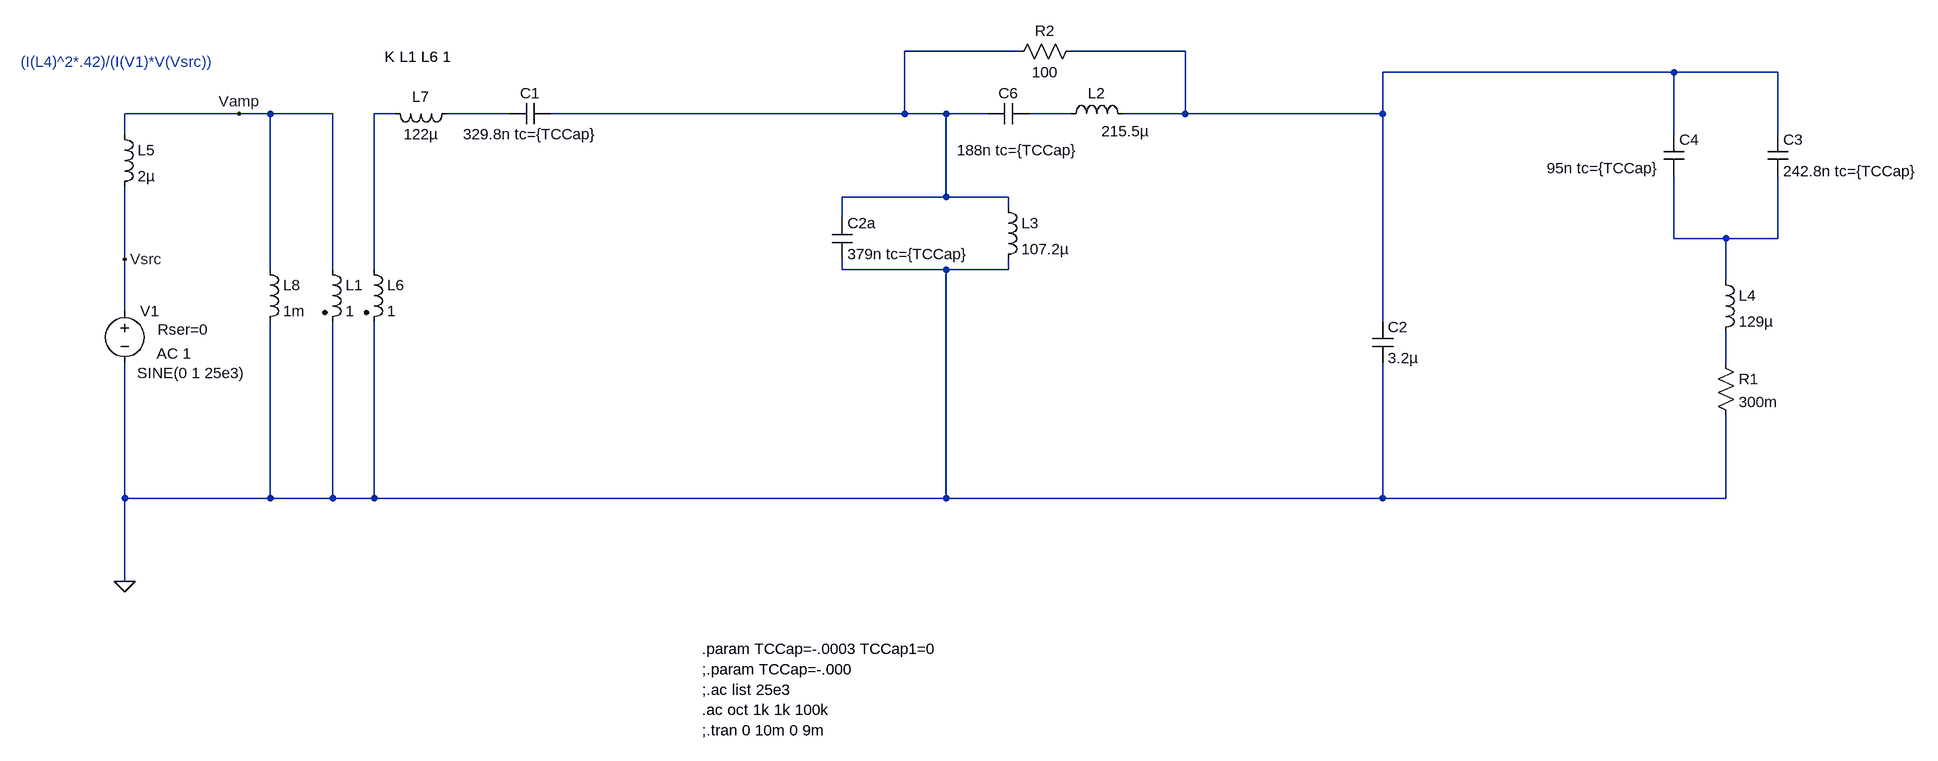
[diagram p0: schematic tx_filter_Meas_values-OS-MPI.asc]
tx_filter_Meas_values-OS-MPI.asc, the LTspice schematic file:
Version 4
SHEET 1 2608 1188
WIRE 1200 -32 1024 -32
WIRE 1456 -32 1280 -32
WIRE 2208 0 1760 0
WIRE 2368 0 2208 0
WIRE 0 64 -176 64
WIRE 48 64 0 64
WIRE 144 64 48 64
WIRE 240 64 208 64
WIRE 416 64 320 64
WIRE 1024 64 1024 -32
WIRE 1024 64 480 64
WIRE 1088 64 1024 64
WIRE 1152 64 1088 64
WIRE 1280 64 1216 64
WIRE 1456 64 1456 -32
WIRE 1456 64 1360 64
WIRE 1760 64 1760 0
WIRE 1760 64 1456 64
WIRE -176 96 -176 64
WIRE 2208 96 2208 0
WIRE 2368 96 2368 0
WIRE 1088 192 1088 64
WIRE 1088 192 928 192
WIRE 1184 192 1088 192
WIRE 1184 208 1184 192
WIRE 928 224 928 192
WIRE 2208 256 2208 160
WIRE 2288 256 2208 256
WIRE 2368 256 2368 160
WIRE 2368 256 2288 256
WIRE -176 288 -176 176
WIRE 48 304 48 64
WIRE 144 304 144 64
WIRE 208 304 208 64
WIRE 928 304 928 288
WIRE 1088 304 928 304
WIRE 1184 304 1184 288
WIRE 1184 304 1088 304
WIRE 2288 320 2288 256
WIRE -176 368 -176 288
WIRE 1760 384 1760 64
WIRE 2288 448 2288 400
WIRE -176 656 -176 448
WIRE 48 656 48 384
WIRE 48 656 -176 656
WIRE 144 656 144 384
WIRE 144 656 48 656
WIRE 208 656 208 384
WIRE 208 656 144 656
WIRE 1088 656 1088 304
WIRE 1088 656 208 656
WIRE 1760 656 1760 448
WIRE 1760 656 1088 656
WIRE 2288 656 2288 528
WIRE 2288 656 1760 656
WIRE -176 784 -176 656
FLAG 0 64 Vamp
FLAG -176 784 0
FLAG -176 288 Vsrc
SYMBOL voltage -176 352 R0
WINDOW 123 49 81 Left 2
WINDOW 39 51 44 Left 2
WINDOW 3 19 111 Left 2
SYMATTR Value2 AC 1
SYMATTR SpiceLine Rser=0
SYMATTR Value SINE(0 1 25e3)
SYMATTR InstName V1
SYMBOL ind 1264 80 R270
WINDOW 0 32 56 VTop 2
WINDOW 3 5 100 VBottom 2
SYMATTR InstName L2
SYMATTR Value 215.5µ
SYMATTR SpiceLine Rser=.3179
SYMBOL cap 912 224 R0
SYMATTR InstName C2a
SYMATTR Value 379n tc={TCCap}
SYMATTR SpiceLine Rser=10m
SYMBOL ind 1168 192 R0
SYMATTR InstName L3
SYMATTR Value 107.2µ
SYMATTR SpiceLine Rser=200m
SYMBOL cap 1216 48 R90
WINDOW 0 0 32 VBottom 2
WINDOW 3 56 18 VTop 2
SYMATTR InstName C6
SYMATTR Value 188n tc={TCCap}
SYMATTR SpiceLine Rser=10m
SYMBOL cap 480 48 R90
WINDOW 0 0 32 VBottom 2
WINDOW 3 32 32 VTop 2
SYMATTR InstName C1
SYMATTR Value 329.8n tc={TCCap}
SYMATTR SpiceLine Rser=10m
SYMBOL ind 2272 304 R0
SYMATTR InstName L4
SYMATTR Value 129µ
SYMBOL res 2272 432 R0
SYMATTR InstName R1
SYMATTR Value 300m
SYMBOL cap 2352 96 R0
SYMATTR InstName C3
SYMATTR Value 242.8n tc={TCCap}
SYMATTR SpiceLine Rser=10m
SYMBOL cap 1744 384 R0
SYMATTR InstName C2
SYMATTR Value 3.2µ
SYMATTR SpiceLine Rser=10m
SYMBOL ind -192 80 R0
SYMATTR InstName L5
SYMATTR Value 2µ
SYMBOL cap 2192 96 R0
WINDOW 3 -180 52 Left 2
SYMATTR Value 95n tc={TCCap}
SYMATTR InstName C4
SYMBOL ind2 128 288 R0
SYMATTR InstName L1
SYMATTR Value 1
SYMATTR Type ind
SYMBOL ind2 192 288 R0
SYMATTR InstName L6
SYMATTR Value 1
SYMATTR Type ind
SYMBOL ind 336 48 R90
WINDOW 0 5 56 VBottom 2
WINDOW 3 32 56 VTop 2
SYMATTR InstName L7
SYMATTR Value 122µ
SYMBOL ind 32 288 R0
SYMATTR InstName L8
SYMATTR Value 1m
SYMBOL res 1296 -48 R90
WINDOW 0 0 56 VBottom 2
WINDOW 3 32 56 VTop 2
SYMATTR InstName R2
SYMATTR Value 100
TEXT 712 888 Left 2 !.param TCCap=-.0003 TCCap1=0\n;.param TCCap=-.000\n;.ac list 25e3\n.ac oct 1k 1k 100k\n;.tran 0 10m 0 9m
TEXT -336 -16 Left 2 ;(I(L4)^2*.42)/(I(V1)*V(Vsrc))
TEXT 224 -24 Left 2 !K L1 L6 1

The netlist it stands for:
* tx_filter_Meas_values-OS-MPI.asc
V1 Vsrc 0 SINE(0 1 25e3) AC 1 Rser=0
L2 N005 N002 215.5µ Rser=.3179
C2a N001 0 379n tc={TCCap} Rser=10m
L3 N001 0 107.2µ Rser=200m
C6 N005 N001 188n tc={TCCap} Rser=10m
C1 N001 N004 329.8n tc={TCCap} Rser=10m
L4 N006 N007 129µ
R1 N007 0 300m
C3 N002 N006 242.8n tc={TCCap} Rser=10m
C2 N002 0 3.2µ Rser=10m
L5 Vamp Vsrc 2µ
C4 N002 N006 95n tc={TCCap}
L1 Vamp 0 1
L6 N003 0 1
L7 N004 N003 122µ
L8 Vamp 0 1m
R2 N002 N001 100
.param TCCap=-.0003 TCCap1=0
;.param TCCap=-.000
;.ac list 25e3
.ac oct 1k 1k 100k
;.tran 0 10m 0 9m
* (I(L4)^2*.42)/(I(V1)*V(Vsrc))
K L1 L6 1
.backanno
.end